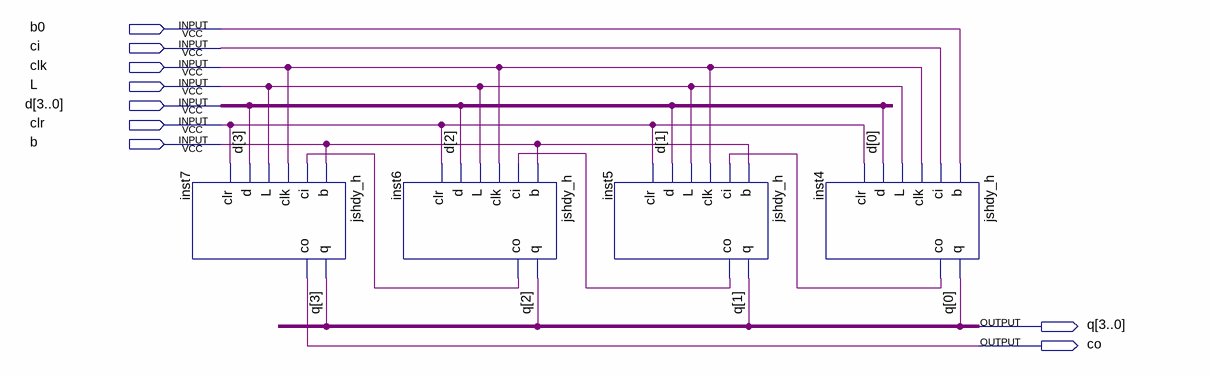
[diagram p0: schematic sheet]
// Quartus schematic jshq0_h.bdf as structural Verilog: 4 symbols, 9 pins
module jshq0_h (
  input  b0,
  input  ci,
  input  clk,
  input  L,
  input  [3:0] d,
  input  clr,
  input  b,
  output [3:0] q,
  output co
);

  wire inst4_co, inst5_co, inst6_co;

  jshdy_h inst7 (.b(b), .ci(inst6_co), .clk(clk), .L(L), .d(d[3]), .clr(clr), .q(q[3]), .co(co));
  jshdy_h inst6 (.b(b), .ci(inst5_co), .clk(clk), .L(L), .d(d[2]), .clr(clr), .q(q[2]), .co(inst6_co));
  jshdy_h inst5 (.b(b), .ci(inst4_co), .clk(clk), .L(L), .d(d[1]), .clr(clr), .q(q[1]), .co(inst5_co));
  jshdy_h inst4 (.b(b0), .ci(ci), .clk(clk), .L(L), .d(d[0]), .clr(clr), .q(q[0]), .co(inst4_co));
endmodule
